# Altium schematic sheet main_board_power.SchDoc
size A
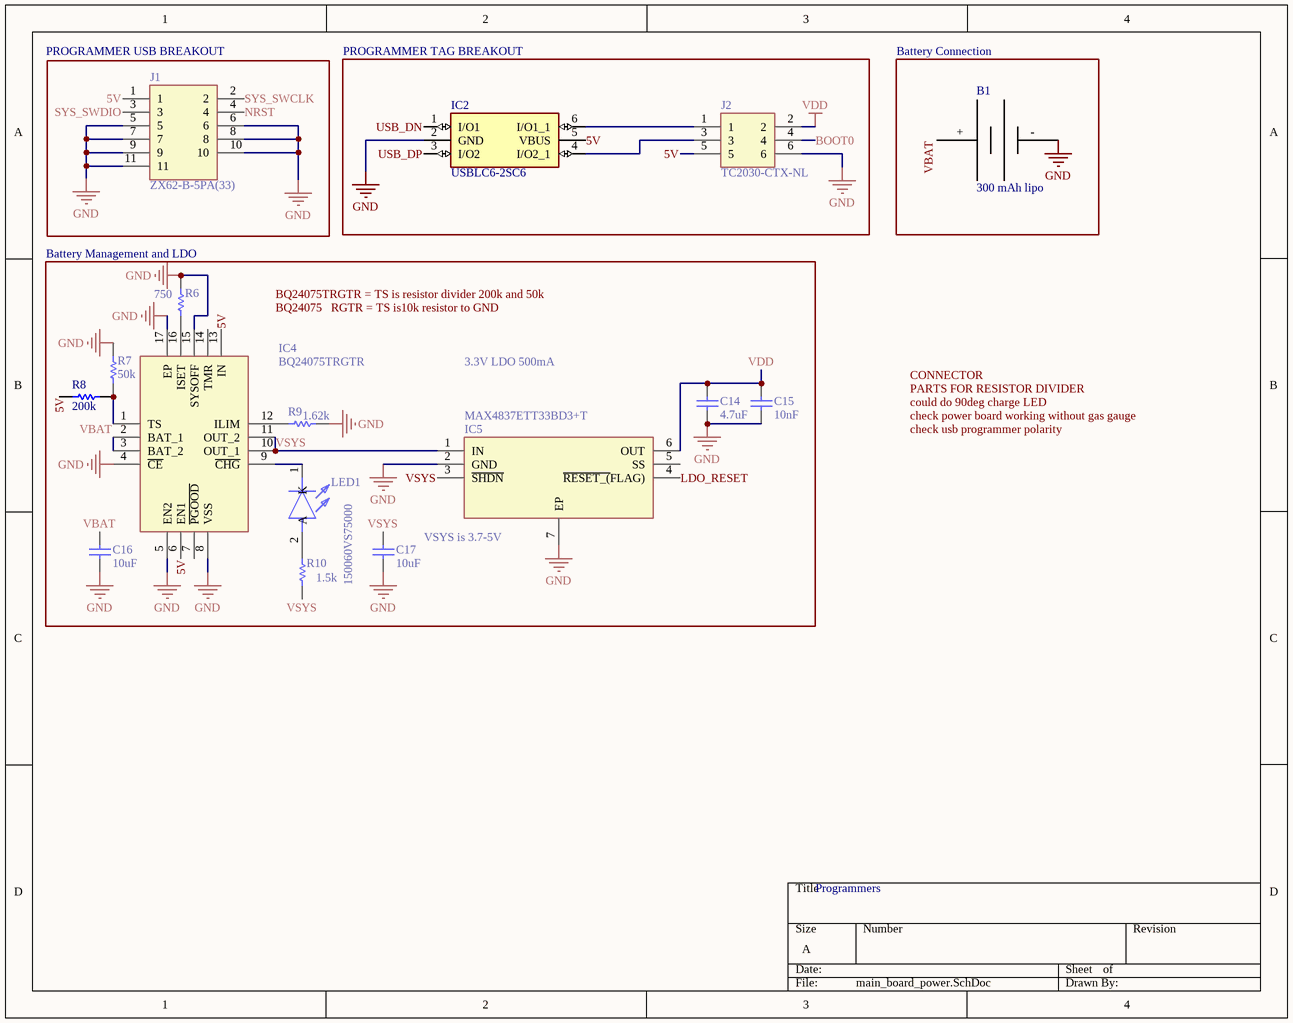
[diagram p0: main_board_power.SchDoc]

## Parts
B1  300 mAh lipo  [RJD3048ST1]
C14  value 4.7uF  [0402C]  (hidden comment: Cap)
C15  value 10nF  [0402C]  (hidden comment: Cap)
C16  value 10uF  [0402C]  (hidden comment: Cap)
C17  value 10uF  [0402C]  (hidden comment: Cap)
IC2  USBLC6-2SC6  [SOT95P280X145-6N]
IC4  BQ24075TRGTR  [QFN50P300X300X100-17N-D]
IC5  MAX4837ETT33BD3+T  [SON95P300X300X80-7N]
J1  ZX62-B-5PA(33)  [ZX62B5PA33]
J2  TC2030-CTX-NL  [TC2030MCPNL10]
LED1  150060VS75000  [LEDC1608X80N]
R6  750  [0402R]
R7  50k  [0402R]
R8  200k  [0402R]
R9  1.62k  [0402R]
R10  1.5k  [0402R]

## Blocks framed on the sheet
PROGRAMMER USB BREAKOUT: J1
PROGRAMMER TAG BREAKOUT: IC2 J2
Battery Connection: B1

## Nets
GND: B1.- C14.2 C15.2 C16.2 C17.2 IC2.2(GND) IC4.4(~{CE}) IC4.5(EN2) IC4.8(VSS) IC4.15(SYSOFF) IC4.17(EP) IC5.2(GND) IC5.7(EP) J1.5 J1.6 J1.7 J1.8 J1.9 J1.10 J1.11 J2.6 R6.1 R7.1 R9.2
VDD: C14.1 C15.1 IC5.6(OUT) J2.2
5V: IC2.5(VBUS) IC4.6(EN1) IC4.13(IN) J1.1 J2.5 R8.1
BOOT0: J2.4
LDO_RESET: IC5.4(~{RESET_(}FLAG))
NRST: J1.4
SYS_SWCLK: J1.2
SYS_SWDIO: J1.3
USB_DN: IC2.1(I/O1)
USB_DP: IC2.3(I/O2)
VBAT: B1.+ C16.1 IC4.2(BAT_1) IC4.3(BAT_2)
VSYS: C17.1 IC4.10(OUT_1) IC4.11(OUT_2) IC5.1(IN) IC5.3(~{SHDN}) R10.2
NetIC2_4: IC2.4(I/O2_1) J2.3
NetIC2_6: IC2.6(I/O1_1) J2.1
NetIC4_1: IC4.1(TS) R7.2 R8.2
NetIC4_9: IC4.9(~{CHG}) LED1.1(K)
NetIC4_12: IC4.12(ILIM) R9.1
NetIC4_16: IC4.16(ISET) R6.2
NetLED1_2: LED1.2(A) R10.1

Not connected (* = marked no-connect by the designer): IC4 7(~{PGOOD}) 14(TMR); IC5 5(SS)

## Notes on the sheet
- (near R6) Battery Management and LDO
- 3.3V LDO 500mA
- (near IC5) VSYS is 3.7-5V
- Programmers
- Labels drawn without touching a wire or pin: BQ24075   RGTR = TS is10k resistor to GND, BQ24075TRGTR = TS is resistor divider 200k and 50k, check power board working without gas gauge, check usb programmer polarity, CONNECTOR, could do 90deg charge LED, PARTS FOR RESISTOR DIVIDER

## Library data of the parts
B1 = RJD3048ST1: Illinois Capacitor 300mAh Lipo Battery; pin to pad: +>Pos ->Neg
C14-C17 = Cap: Capacitor; Published: 8-Jun-2000; LatestRevisionDate: 17-Jul-2002; LatestRevisionNote: Re-released for DXP Platform.; PackageReference: RAD-0.3; Publisher: Altium Limited; PackageDescription: Radial Cap, Thru-Hole; 2 Leads; 0.3 in Pin Spacing
IC2 = USBLC6-2SC6: Integrated Circuit; Manufacturer_Name: STMicroelectronics; Allied_Number: 70389689; Datasheet Link: http://www.st.com/st-web-ui/static/active/en/resource/technical/document/datasheet/CD00050750.pdf; Height: 1.45mm; Manufacturer_Part_Number: USBLC6-2SC6; Mouser Part Number: 511-USBLC6-2SC6; Mouser Price/Stock: https://www.mouser.com/Search/Refine.aspx?Keyword=511-USBLC6-2SC6; RS Part Number: 9206266; RS Price/Stock: https://uk.rs-online.com/web/p/products/9206266; Allied Price/Stock: http://www.alliedelec.com/stmicroelectronics-usblc6-2sc6/70389689/
IC4 = BQ24075TRGTR: Integrated Circuit; Manufacturer_Name: Texas Instruments; Datasheet Link: http://componentsearchengine.com/Datasheets/1/BQ24075TRGTR.pdf; Height: 1mm; Manufacturer_Part_Number: BQ24075TRGTR; Mouser Part Number: 595-BQ24075TRGTR; Mouser Price/Stock: https://www.mouser.com/Search/Refine.aspx?Keyword=595-BQ24075TRGTR
IC5 = MAX4837ETT33BD3+T: Integrated Circuit; Manufacturer_Name: Maxim Integrated; Datasheet Link: https://datasheets.maximintegrated.com/en/ds/MAX4836-MAX4837.pdf; Height: 0.8mm; Manufacturer_Part_Number: MAX4837ETT33BD3+T
J1 = ZX62-B-5PA(33): Connector; Manufacturer_Name: Hirose; Datasheet Link: http://www.mouser.com/ds/2/185/ZX_catalog-939768.pdf; Height: 2.8mm; Manufacturer_Part_Number: ZX62-B-5PA(33); Mouser Part Number: 798-ZX62-B-5PA33; Mouser Price/Stock: https://www.mouser.com/Search/Refine.aspx?Keyword=798-ZX62-B-5PA33; RS Part Number: 1362267; RS Price/Stock: http://uk.rs-online.com/web/p/products/1362267
J2 = TC2030-CTX-NL: Connector; Manufacturer_Name: Tag Connect; Datasheet Link: http://www.tag-connect.com/Materials/TC2030-CTX.pdf; Height: 18mm; Manufacturer_Part_Number: TC2030-CTX-NL
LED1 = 150060VS75000: LED; Manufacturer_Name: Wurth Elektronik; Datasheet Link: http://docs-emea.rs-online.com/webdocs/1302/0900766b81302e1e.pdf; Height: 0.8mm; Manufacturer_Part_Number: 150060VS75000; Mouser Part Number: 710-150060VS75000; Mouser Price/Stock: https://www.mouser.com/Search/Refine.aspx?Keyword=710-150060VS75000; RS Part Number: 8154215P; RS Price/Stock: http://uk.rs-online.com/web/p/products/8154215P
R6-R10 = Resistor